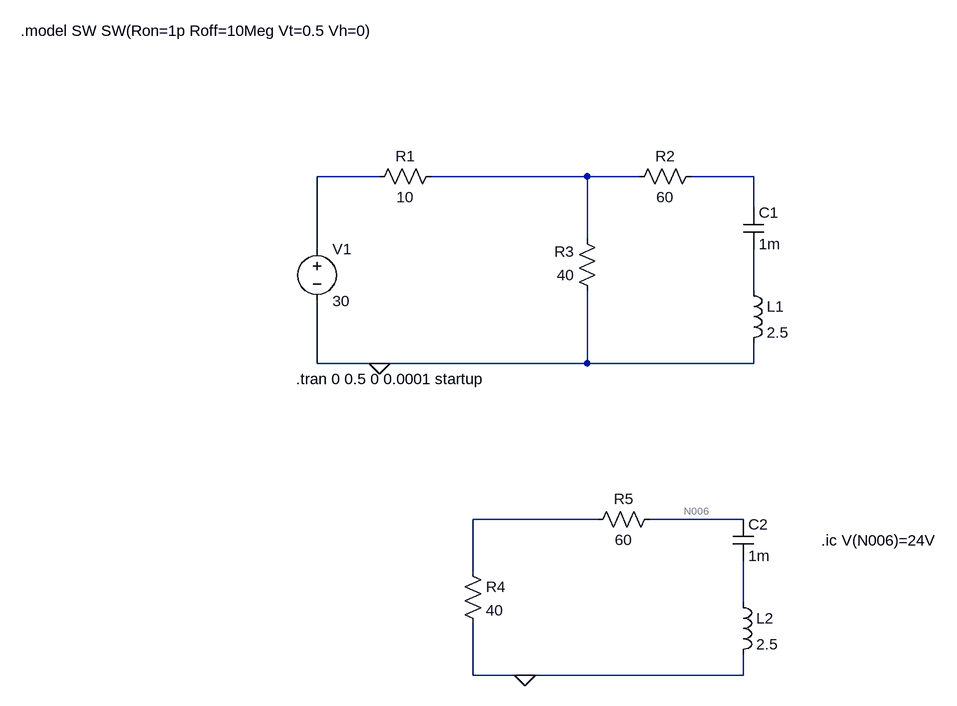
[diagram p0: schematic Q8_16.asc]
Q8_16.asc, the LTspice schematic file:
Version 4
SHEET 1 972 804
WIRE 96 16 0 16
WIRE 416 16 176 16
WIRE 496 16 416 16
WIRE 672 16 576 16
WIRE 672 64 672 16
WIRE 416 112 416 16
WIRE 0 128 0 16
WIRE 672 192 672 128
WIRE 0 304 0 208
WIRE 96 304 0 304
WIRE 416 304 416 192
WIRE 416 304 96 304
WIRE 672 304 672 272
WIRE 672 304 416 304
WIRE 432 544 240 544
WIRE 656 544 512 544
WIRE 240 624 240 544
WIRE 656 672 656 608
WIRE 240 784 240 704
WIRE 320 784 240 784
WIRE 656 784 656 752
WIRE 656 784 320 784
FLAG 96 304 0
FLAG 320 784 0
SYMBOL voltage 0 112 R0
WINDOW 123 0 0 Left 0
WINDOW 39 0 0 Left 0
SYMATTR InstName V1
SYMATTR Value 30
SYMBOL res 192 0 R90
WINDOW 0 0 56 VBottom 2
WINDOW 3 32 56 VTop 2
SYMATTR InstName R1
SYMATTR Value 10
SYMBOL res 592 0 R90
WINDOW 0 0 56 VBottom 2
WINDOW 3 32 56 VTop 2
SYMATTR InstName R2
SYMATTR Value 60
SYMBOL res 432 208 R180
WINDOW 0 36 76 Left 2
WINDOW 3 36 40 Left 2
SYMATTR InstName R3
SYMATTR Value 40
SYMBOL ind 656 176 R0
SYMATTR InstName L1
SYMATTR Value 2.5
SYMBOL cap 656 64 R0
SYMATTR InstName C1
SYMATTR Value 1m
SYMBOL res 224 608 R0
SYMATTR InstName R4
SYMATTR Value 40
SYMBOL res 528 528 R90
WINDOW 0 0 56 VBottom 2
WINDOW 3 32 56 VTop 2
SYMATTR InstName R5
SYMATTR Value 60
SYMBOL cap 640 544 R0
SYMATTR InstName C2
SYMATTR Value 1m
SYMBOL ind 640 656 R0
SYMATTR InstName L2
SYMATTR Value 2.5
TEXT -32 328 Left 2 !.tran 0 0.5 0 0.0001 startup
TEXT -456 -208 Left 2 !.model SW SW(Ron=1p Roff=10Meg Vt=0.5 Vh=0)
TEXT 776 576 Left 2 !.ic V(N006)=24V

The netlist it stands for:
* Q8_16.asc
V1 N001 0 30
R1 N002 N001 10
R2 N003 N002 60
R3 0 N002 40
L1 N004 0 2.5
C1 N003 N004 1m
R4 N005 0 40
R5 N006 N005 60
C2 N006 N007 1m
L2 N007 0 2.5
.tran 0 0.5 0 0.0001 startup
.model SW SW(Ron=1p Roff=10Meg Vt=0.5 Vh=0)
.ic V(N006)=24V
.backanno
.end